# Altium schematic sheet Busswitch_A.SchDoc
size A4; CompanyName: Technische Hochschule Nürnberg Georg Simon Ohm; Organization: UltraZohm; Address1: Kesslerplatz 12; Address2: 90489 Nürnberg; Address3: GERMANY; DocumentNumber: 12; SheetNumber: 12; SheetTotal: 12; Website: www.ultrazohm.com
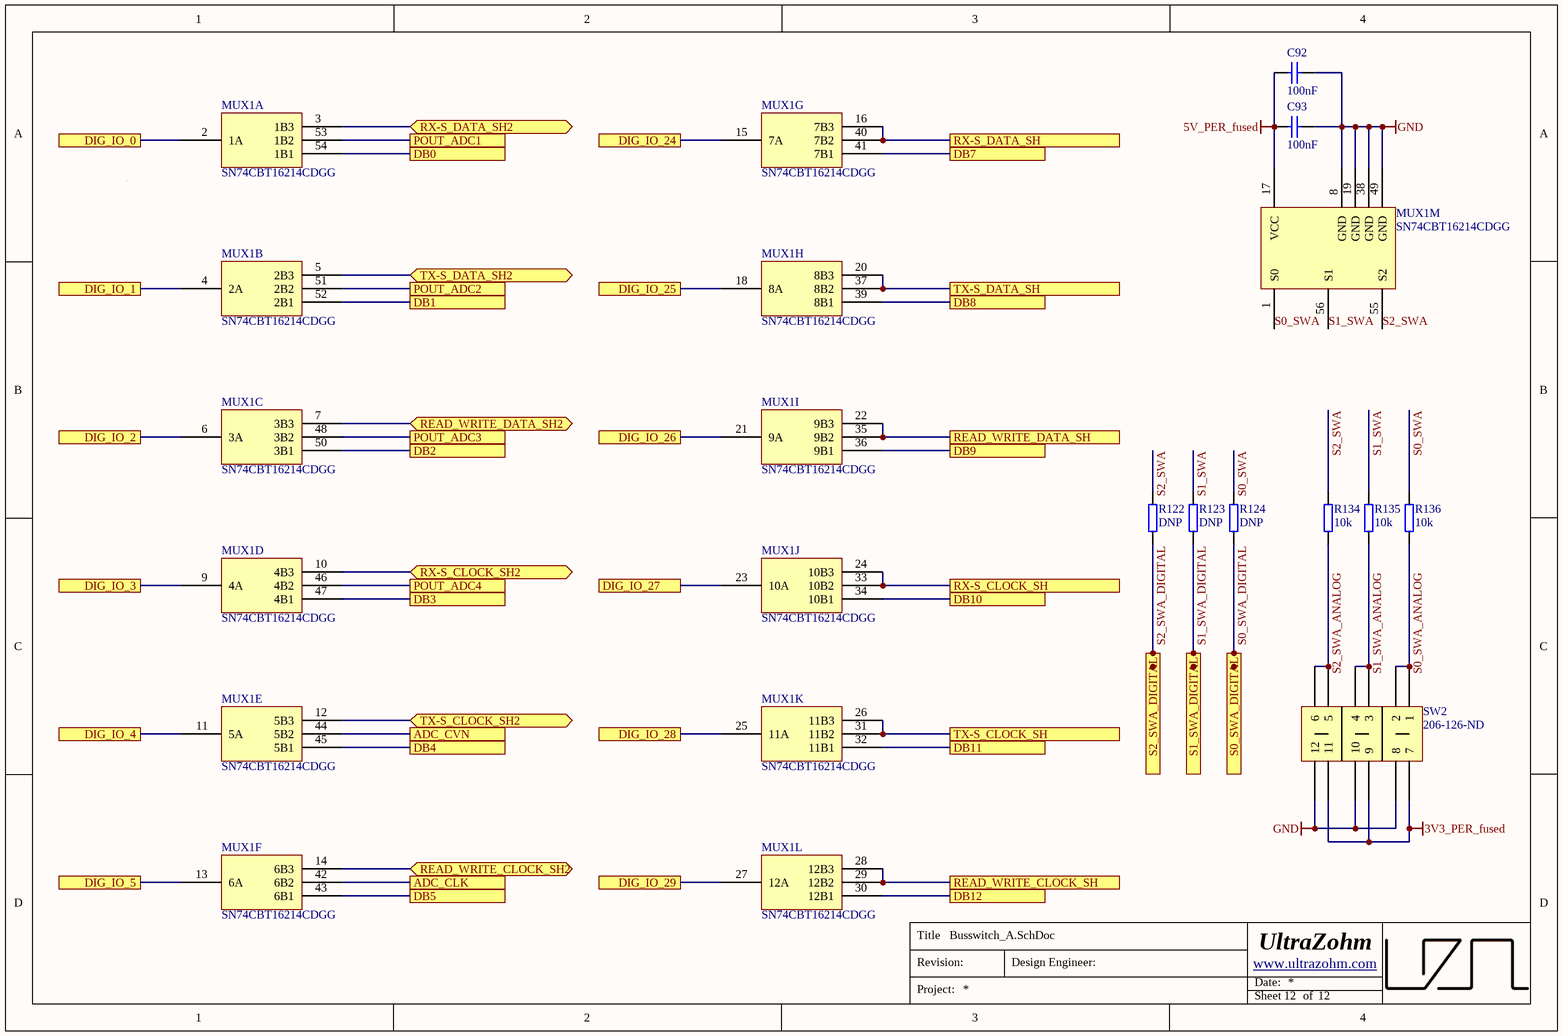
[diagram p0: Busswitch_A.SchDoc]

## Parts
C92  100nF  [CAPC1608X07N]
C93  100nF  [CAPC1608X07N]
MUX1  SN74CBT16214CDGG  [TSSOP50P810X120-56N]  (parts A,B,C,D,E,F,G,H,I,J,K,L,M of 13)
R122  DNP  [RESC1608X06N]
R123  DNP  [RESC1608X06N]
R124  DNP  [RESC1608X06N]
R134  10k  [RESC1608X06N]
R135  10k  [RESC1608X06N]
R136  10k  [RESC1608X06N]
SW2  Supplier Part Number 1: 206-126-ND  [206-123]  (hidden comment: 206-126)

## Ports
ADC_CLK, ADC_CVN, DB0, DB1, DB2, DB3, DB4, DB5, DB7, DB8, DB9, DB10, DB11, DB12, DIG_IO_0, DIG_IO_1, DIG_IO_2, DIG_IO_3, DIG_IO_4, DIG_IO_5, DIG_IO_24, DIG_IO_25, DIG_IO_26, DIG_IO_27, DIG_IO_28, DIG_IO_29, POUT_ADC1, POUT_ADC2, POUT_ADC3, POUT_ADC4, READ_WRITE_CLOCK_SH, READ_WRITE_CLOCK_SH2 (bidir), READ_WRITE_DATA_SH, READ_WRITE_DATA_SH2 (bidir), RX-S_CLOCK_SH, RX-S_CLOCK_SH2 (bidir), RX-S_DATA_SH, RX-S_DATA_SH2 (bidir), S0_SWA_DIGITAL, S1_SWA_DIGITAL, S2_SWA_DIGITAL, TX-S_CLOCK_SH, TX-S_CLOCK_SH2 (bidir), TX-S_DATA_SH, TX-S_DATA_SH2 (bidir)

## Nets
3V3_PER_fused: SW2.7 SW2.9 SW2.11
5V_PER_fused: C92.1 C93.1 MUX1.17(VCC)
GND: C92.2 C93.2 MUX1.8(GND) MUX1.19(GND) MUX1.38(GND) MUX1.49(GND) SW2.8 SW2.10 SW2.12
ADC_CLK: MUX1.42(6B2) ; port ADC_CLK
ADC_CVN: MUX1.44(5B2) ; port ADC_CVN
DB0: MUX1.54(1B1) ; port DB0
DB1: MUX1.52(2B1) ; port DB1
DB2: MUX1.50(3B1) ; port DB2
DB3: MUX1.47(4B1) ; port DB3
DB4: MUX1.45(5B1) ; port DB4
DB5: MUX1.43(6B1) ; port DB5
DB7: MUX1.41(7B1) ; port DB7
DB8: MUX1.39(8B1) ; port DB8
DB9: MUX1.36(9B1) ; port DB9
DB10: MUX1.34(10B1) ; port DB10
DB11: MUX1.32(11B1) ; port DB11
DB12: MUX1.30(12B1) ; port DB12
DIG_IO_0: MUX1.2(1A) ; port DIG_IO_0
DIG_IO_1: MUX1.4(2A) ; port DIG_IO_1
DIG_IO_2: MUX1.6(3A) ; port DIG_IO_2
DIG_IO_3: MUX1.9(4A) ; port DIG_IO_3
DIG_IO_4: MUX1.11(5A) ; port DIG_IO_4
DIG_IO_5: MUX1.13(6A) ; port DIG_IO_5
DIG_IO_24: MUX1.15(7A) ; port DIG_IO_24
DIG_IO_25: MUX1.18(8A) ; port DIG_IO_25
DIG_IO_26: MUX1.21(9A) ; port DIG_IO_26
DIG_IO_27: MUX1.23(10A) ; port DIG_IO_27
DIG_IO_28: MUX1.25(11A) ; port DIG_IO_28
DIG_IO_29: MUX1.27(12A) ; port DIG_IO_29
POUT_ADC1: MUX1.53(1B2) ; port POUT_ADC1
POUT_ADC2: MUX1.51(2B2) ; port POUT_ADC2
POUT_ADC3: MUX1.48(3B2) ; port POUT_ADC3
POUT_ADC4: MUX1.46(4B2) ; port POUT_ADC4
READ_WRITE_CLOCK_SH: MUX1.28(12B3) MUX1.29(12B2) ; port READ_WRITE_CLOCK_SH
READ_WRITE_CLOCK_SH2: MUX1.14(6B3) ; port READ_WRITE_CLOCK_SH2
READ_WRITE_DATA_SH: MUX1.22(9B3) MUX1.35(9B2) ; port READ_WRITE_DATA_SH
READ_WRITE_DATA_SH2: MUX1.7(3B3) ; port READ_WRITE_DATA_SH2
RX-S_CLOCK_SH: MUX1.24(10B3) MUX1.33(10B2) ; port RX-S_CLOCK_SH
RX-S_CLOCK_SH2: MUX1.10(4B3) ; port RX-S_CLOCK_SH2
RX-S_DATA_SH: MUX1.16(7B3) MUX1.40(7B2) ; port RX-S_DATA_SH
RX-S_DATA_SH2: MUX1.3(1B3) ; port RX-S_DATA_SH2
S0_SWA: MUX1.1(S0) R124.2 R136.2
S0_SWA_ANALOG: R136.1 SW2.1 SW2.2
S0_SWA_DIGITAL: R124.1 ; port S0_SWA_DIGITAL
S1_SWA: MUX1.56(S1) R123.2 R135.2
S1_SWA_ANALOG: R135.1 SW2.3 SW2.4
S1_SWA_DIGITAL: R123.1 ; port S1_SWA_DIGITAL
S2_SWA: MUX1.55(S2) R122.2 R134.2
S2_SWA_ANALOG: R134.1 SW2.5 SW2.6
S2_SWA_DIGITAL: R122.1 ; port S2_SWA_DIGITAL
TX-S_CLOCK_SH: MUX1.26(11B3) MUX1.31(11B2) ; port TX-S_CLOCK_SH
TX-S_CLOCK_SH2: MUX1.12(5B3) ; port TX-S_CLOCK_SH2
TX-S_DATA_SH: MUX1.20(8B3) MUX1.37(8B2) ; port TX-S_DATA_SH
TX-S_DATA_SH2: MUX1.5(2B3) ; port TX-S_DATA_SH2

## Notes on the sheet
- Title
- Revision:
- Design Engineer:
- Date:
- Project:
- Sheet
- of

## Library data of the parts
C92 C93 = Cap_0603: MPN: 885012206071; MF: Würth; Voltage: 25V; Value: 100nF; Supplier 1: Mouser; Supplier 2: *; Supplier Part Number 1: 710-885012206071; Supplier Part Number 2: *
MUX1 = SN74CBT16214CDGG: Multiplexer/Demultiplexer Bus Switch 1-Element CMOS 36-IN 56-Pin TSSOP Tube; Manufacturer: Texas Instruments; Supplier 1: Arrow Electronics; Manufacturer Part Number: SN74CBT16214CDGG; RoHS: Yes; Case/Package: TSSOP; RoHS Compliant: Yes; Supplier Part Number 1: SN74CBT16214CDGG
R122-R124 R134-R136 = R_0603: MPN: CRCW06030000Z0EAC; MF: Vishay; Supplier 1: Mouser; Supplier Part Number 1: 71-CRCW06030000Z0EAC
  R122-R124: Value: DNP
  R134-R136: Value: 10k
SW2 = 206-126: Switch DIP OFF ON SPDT 6 Raised Slide 0.05A 24VDC PC Pins 2.54mm Thru-Hole Tube; Manufacturer: CTS; Body Material: Plastic; Voltage Rating (DC): 24V; Number of Positions: 6; Current Rating: 50mA; Electrical Life: 10000Cycles; Actuator Type: Slide (Standard); Pitch: 0.1inch; Washable: No; Supplier 1: Digi-Key; Manufacturer Part Number: 206-126; RoHS: Yes; Category: DIP Switches; Pricing 1: 1005=1,10898 (USD); Mount: Through Hole; Contact Plating: Gold; Min Operating Temperature: -55°C; Max Operating Temperature: 85°C; Packaging: Rail/Tube; Termination: PC Pin; Package Quantity: 15; Throw Configuration: SPDT; Series: 206; Max Voltage Rating (DC): 24V; Length: 1.286inch; Terminal Pitch: 2.54mm; Radiation Hardening: No; RoHS Compliant: Yes; ComponentLink1URL: https://datasheet.ciiva.com/8677/206-208-8677008.pdf?src-supplier=Avnet; ComponentLink1Description: https://datasheet.ciiva.com/8677/206-208-8677008.pdf?src-supplier=Avnet; ComponentLink2URL: https://datasheet.ciiva.com/12451/206-208-11732-12451385.pdf?src-supplier=Mouser; ComponentLink2Description: https://datasheet.ciiva.com/12451/206-208-11732-12451385.pdf?src-supplier=Mouser